# EAGLE design parallella_io (EAGLE 7.2.0)
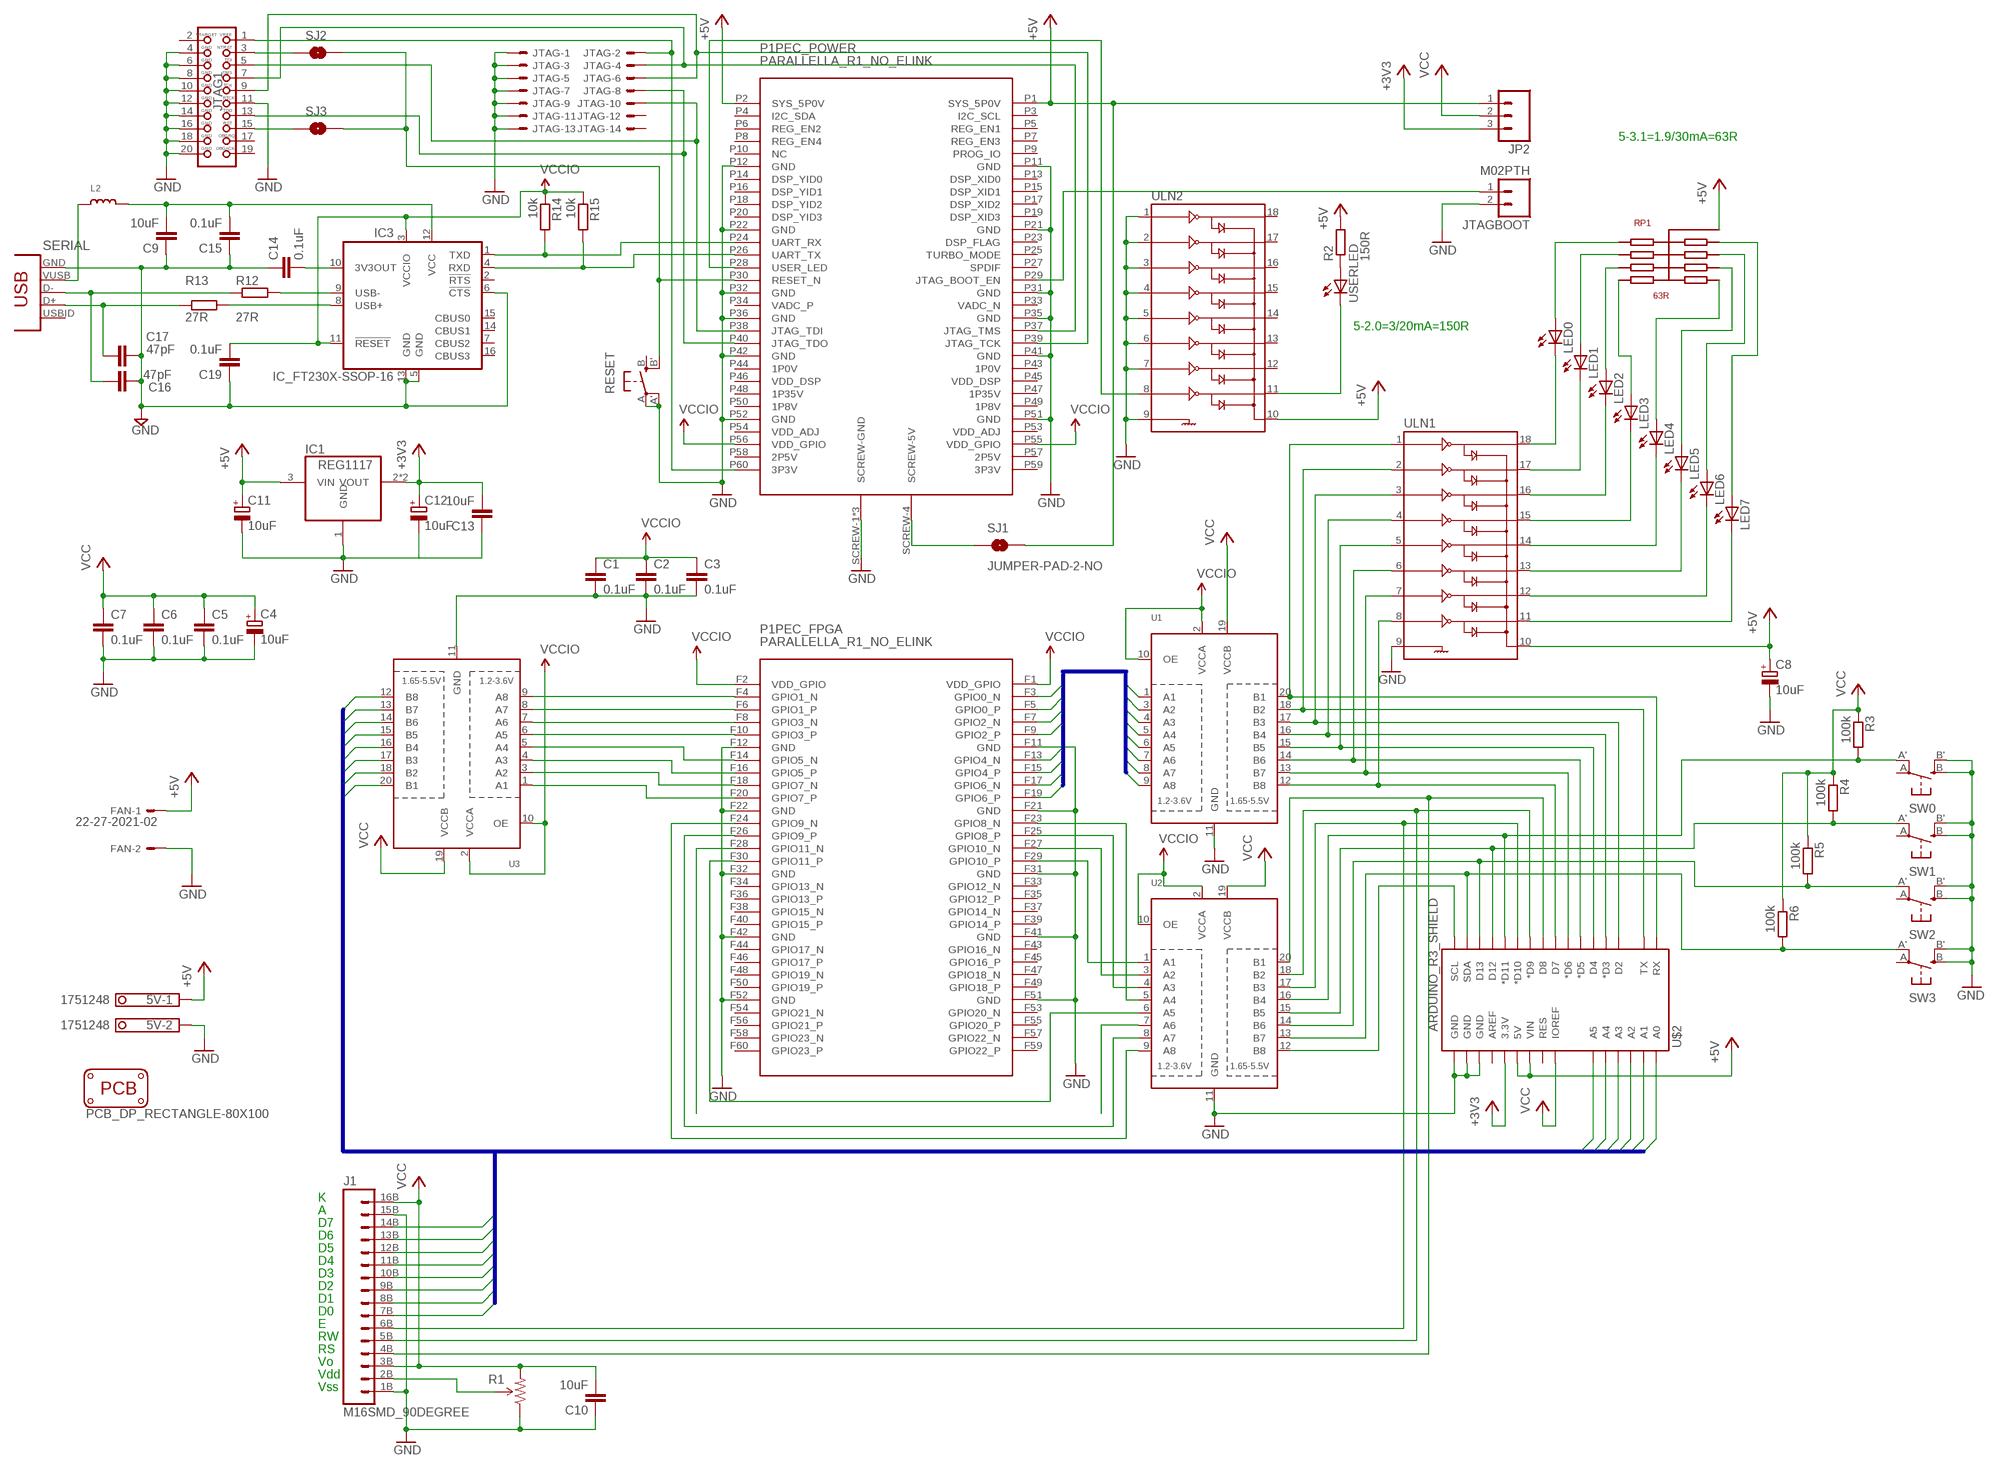
[diagram p0: schematic, sheet 1]

## Parts
5V  1751248  [1751248]
C1  0.1uF  C-EUC0603-N  [C0603-N]
C2  0.1uF  C-EUC0603-N  [C0603-N]
C3  0.1uF  C-EUC0603-N  [C0603-N]
C4  10uF  CPOL-EUD/7343-31W  [D/7343-31W]
C5  0.1uF  C-EUC0603-N  [C0603-N]
C6  0.1uF  C-EUC0603-N  [C0603-N]
C7  0.1uF  C-EUC0603-N  [C0603-N]
C8  10uF  CPOL-EUD/7343-31W  [D/7343-31W]
C9  10uF  C-EUC0603-N  [C0603-N]
C10  10uF  C-EUC0603-N  [C0603-N]
C11  10uF  CPOL-EUD/7343-31W  [D/7343-31W]
C12  10uF  CPOL-EUD/7343-31W  [D/7343-31W]
C13  10uF  C-EUC0603-N  [C0603-N]
C14  0.1uF  C-EUC0603-N  [C0603-N]
C15  0.1uF  C-EUC0603-N  [C0603-N]
C16  47pF  C-EUC0603-N  [C0603-N]
C17  47pF  C-EUC0603-N  [C0603-N]
C19  0.1uF  C-EUC0603-N  [C0603-N]
FAN  22-27-2021-02  [6410-02]
IC1  REG1117  [SOT223]
IC3  IC_FT230X-SSOP-16  [SSOP-16-FTDI]
J1  M16SMD_90DEGREE  [1X16_SMD_90DEGREE]
JP2  M03LONGPADS  [1X03_LONGPADS]
JTAG  87758-1416  [87758-1416]
JTAG1  JTAG-ARM  [JTAG-ARM]
JTAGBOOT  M02PTH  [1X02]
L2  INDUCTOR0805  [0805]
LED0  LED1206  [LED-1206]
LED1  LED1206  [LED-1206]
LED2  LED1206  [LED-1206]
LED3  LED1206  [LED-1206]
LED4  LED1206  [LED-1206]
LED5  LED1206  [LED-1206]
LED6  LED1206  [LED-1206]
LED7  LED1206  [LED-1206]
P1  PARALLELLA_R1_NO_ELINK  [PARALLELLA_R1_NO_ELINK]
PCB1  PCB_DP_RECTANGLE-80X100  [DP10080_V1]
R1  TRIMPOT  [TRIMPOT-5MM-V2]
R2  150R  R-EU_R0603-N  [R0603-N]
R3  100k  R-EU_R0603-N  [R0603-N]
R4  100k  R-EU_R0603-N  [R0603-N]
R5  100k  R-EU_R0603-N  [R0603-N]
R6  100k  R-EU_R0603-N  [R0603-N]
R12  27R  R-EU_R0603-N  [R0603-N]
R13  27R  R-EU_R0603-N  [R0603-N]
R14  10k  R-EU_R0603-S  [R0603-S]
R15  10k  R-EU_R0603-N  [R0603-N]
RESET  SPST_TACT-EVQQ2  [EVQ-Q2]
RP1  63R  745C101745C101  [745C10]
SERIAL  CON-USB-F-MINI-B  [CONN_USB_MINI-B]
SJ1  JUMPER-PAD-2-NO  [PAD-JUMPER-2-NO_NO_SILK]
SJ2  JUMPER-PAD-2-NO  [PAD-JUMPER-2-NO_NO_SILK]
SJ3  JUMPER-PAD-2-NO  [PAD-JUMPER-2-NO_NO_SILK]
SW0  SPST_TACT-EVQQ2  [EVQ-Q2]
SW1  SPST_TACT-EVQQ2  [EVQ-Q2]
SW2  SPST_TACT-EVQQ2  [EVQ-Q2]
SW3  SPST_TACT-EVQQ2  [EVQ-Q2]
U1  TXB0108PWR  [TSSOP20]
U2  TXB0108PWR  [TSSOP20]
U3  TXB0108PWR  [TSSOP20]
U$2  ARDUINO_R3_SHIELD  [UNO_R3_SHIELD]
ULN1  ULN2803SOICW  [SO18L]
ULN2  ULN2803SOICW  [SO18L]
USERLED  LED1206  [LED-1206]

## Nets
3V3OUT: C14.2 IC3.10(3V3OUT)
+3V3: C12.+ C13.2 IC1.2(VOUT) IC1.4(VOUT) JP2.3 U$2.3.3V
+5V: 5V.1 C8.+ C11.+ FAN.1 IC1.3(VIN) JP2.1 P1.P1(PEC_POWER:SYS_5P0V) P1.P2(PEC_POWER:SYS_5P0V) R2.2 RP1.1(COMMON) RP1.6(COMMON) SJ1.2 U$2.5V U$2.VIN ULN1.10 ULN2.10
A0: J1.7B U3.20(B1) U$2.A0
A1: J1.8B U3.18(B2) U$2.A1
A2: J1.9B U3.17(B3) U$2.A2
A3: J1.10B U3.16(B4) U$2.A3
A4: J1.11B U3.15(B5) U$2.A4
A5: J1.12B U3.14(B6) U$2.A5
A6: J1.13B U3.13(B7)
A7: J1.14B U3.12(B8)
B0: P1.F19(PEC_FPGA:GPIO6_P) U1.1(A1)
B1: P1.F17(PEC_FPGA:GPIO6_N) U1.3(A2)
B2: P1.F15(PEC_FPGA:GPIO4_P) U1.4(A3)
B3: P1.F13(PEC_FPGA:GPIO4_N) U1.5(A4)
B4: P1.F9(PEC_FPGA:GPIO2_P) U1.6(A5)
B5: P1.F7(PEC_FPGA:GPIO2_N) U1.7(A6)
B6: P1.F5(PEC_FPGA:GPIO0_P) U1.8(A7)
B7: P1.F3(PEC_FPGA:GPIO0_N) U1.9(A8)
GND: 5V.2 C1.2 C2.2 C3.2 C4.- C5.2 C6.2 C7.2 C8.- C9.1 C10.1 C11.- C12.- C13.1 C14.1 C15.1 C16.2 C17.2 C19.1 FAN.2 IC1.1(GND) IC3.5(GND) IC3.6(!CTS) IC3.13(GND) J1.1B J1.15B JTAG1.4 JTAG1.6 JTAG1.8 JTAG1.10 JTAG1.11 JTAG1.12 JTAG1.14 JTAG1.16 JTAG1.18 JTAG1.20 JTAG.1 JTAG.3 JTAG.5 JTAG.7 JTAG.9 JTAG.11 JTAG.13 JTAGBOOT.2 P1.F11(PEC_FPGA:GND) P1.F12(PEC_FPGA:GND) P1.F21(PEC_FPGA:GND) P1.F22(PEC_FPGA:GND) P1.F31(PEC_FPGA:GND) P1.F32(PEC_FPGA:GND) P1.F41(PEC_FPGA:GND) P1.F42(PEC_FPGA:GND) P1.F51(PEC_FPGA:GND) P1.F52(PEC_FPGA:GND) P1.P11(PEC_POWER:GND) P1.P12(PEC_POWER:GND) P1.P21(PEC_POWER:GND) P1.P22(PEC_POWER:GND) P1.P31(PEC_POWER:GND) P1.P32(PEC_POWER:GND) P1.P35(PEC_POWER:GND) P1.P36(PEC_POWER:GND) P1.P41(PEC_POWER:GND) P1.P42(PEC_POWER:GND) P1.P51(PEC_POWER:GND) P1.P52(PEC_POWER:GND) P1.SCREW-1(PEC_POWER:SCREW-GND) P1.SCREW-2(PEC_POWER:SCREW-GND) P1.SCREW-3(PEC_POWER:SCREW-GND) R1.A(CCW) RESET.A'(P1) RESET.A(P) SERIAL.GND SW0.B'(S1) SW0.B(S) SW1.B'(S1) SW1.B(S) SW2.B'(S1) SW2.B(S) SW3.B'(S1) SW3.B(S) U1.11(GND) U2.11(GND) U3.11(GND) U$2.GND@0(GND) U$2.GND@1(GND) U$2.GND@2(GND) ULN1.9 ULN2.1 ULN2.2 ULN2.3 ULN2.4 ULN2.5 ULN2.6 ULN2.7 ULN2.9
N$1: JTAGBOOT.1 P1.P29(PEC_POWER:JTAG_BOOT_EN)
N$2: P1.F10(PEC_FPGA:GPIO3_P) U3.6(A5)
N$3: P1.F8(PEC_FPGA:GPIO3_N) U3.7(A6)
N$4: P1.F6(PEC_FPGA:GPIO1_P) U3.8(A7)
N$5: P1.F4(PEC_FPGA:GPIO1_N) U3.9(A8)
N$6: JTAG1.1 JTAG.2 P1.P60(PEC_POWER:3P3V)
N$7: JTAG1.3 SJ2.1
N$8: P1.SCREW-4(PEC_POWER:SCREW-5V) SJ1.1
N$9: P1.F23(PEC_FPGA:GPIO8_N) U2.5(A4)
N$10: P1.F25(PEC_FPGA:GPIO8_P) U2.4(A3)
N$11: P1.F27(PEC_FPGA:GPIO10_N) U2.3(A2)
N$12: P1.F29(PEC_FPGA:GPIO10_P) U2.1(A1)
N$13: P1.F30(PEC_FPGA:GPIO11_P) U2.6(A5)
N$14: P1.F28(PEC_FPGA:GPIO11_N)
N$15: P1.F26(PEC_FPGA:GPIO9_P) U2.8(A7)
N$16: P1.F24(PEC_FPGA:GPIO9_N) U2.9(A8)
N$17: R2.1 USERLED.A
N$18: ULN2.11 USERLED.C
N$19: P1.P28(PEC_POWER:USER_LED) ULN2.8
N$20: JTAG1.15 SJ3.1
N$21: P1.F14(PEC_FPGA:GPIO5_N) U3.5(A4)
N$22: P1.F16(PEC_FPGA:GPIO5_P) U3.4(A3)
N$23: P1.F18(PEC_FPGA:GPIO7_N) U3.3(A2)
N$24: P1.F20(PEC_FPGA:GPIO7_P) U3.1(A1)
N$25: U1.16(B4) U$2.D3(*D3) ULN1.4
N$26: U1.15(B5) U$2.D4 ULN1.5
N$27: U1.14(B6) U$2.D5(*D5) ULN1.6
N$28: U1.20(B1) U$2.RX ULN1.1
N$29: U1.18(B2) U$2.TX ULN1.2
N$30: U1.17(B3) U$2.D2 ULN1.3
N$31: U1.13(B7) U$2.D6(*D6) ULN1.7
N$32: U1.12(B8) U$2.D7 ULN1.8
N$33: J1.4B U2.20(B1) U$2.D8
N$34: J1.5B U2.18(B2) U$2.D9(*D9)
N$35: J1.6B U2.17(B3) U$2.D10(*D10)
N$36: R3.2 SW0.A'(P1) U2.16(B4) U$2.D11(*D11)
N$37: JTAG1.13 JTAG.8 P1.P40(PEC_POWER:JTAG_TDO)
N$38: R6.2 SW3.A'(P1) U2.13(B7) U$2.SDA
N$39: R5.2 SW2.A'(P1) U2.14(B6) U$2.D13
N$40: R4.2 SW1.A'(P1) U2.15(B5) U$2.D12
N$41: U2.12(B8) U$2.SCL
N$43: JTAG1.5 JTAG.10 P1.P38(PEC_POWER:JTAG_TDI)
N$45: JTAG1.7 JTAG.4 P1.P37(PEC_POWER:JTAG_TMS)
N$46: JTAG1.9 JTAG.6 P1.P39(PEC_POWER:JTAG_TCK)
N$47: LED0.A RP1.10(R8)
N$48: LED1.A RP1.9(R7)
N$49: LED2.A RP1.8(R6)
N$50: LED3.A RP1.7(R5)
N$51: LED4.A RP1.5(R4)
N$52: LED0.C ULN1.18
N$53: LED1.C ULN1.17
N$54: LED2.C ULN1.16
N$55: LED3.C ULN1.15
N$56: LED4.C ULN1.14
N$57: LED5.C ULN1.13
N$58: LED6.C ULN1.12
N$59: LED7.C ULN1.11
N$60: LED5.A RP1.4(R3)
N$61: LED6.A RP1.3(R2)
N$62: LED7.A RP1.2(R1)
N$63: C16.1 R12.1 SERIAL.D-
N$64: P1.P30(PEC_POWER:RESET_N) RESET.B'(S1) SJ2.2 SJ3.2
N$65: C17.1 R13.1 SERIAL.D+
N$66: J1.2B R1.B(WIPER)
N$67: IC3.9(USB-) R12.2
N$68: IC3.8(USB+) R13.2
N$69: U2.7(A6)
N$70: L2.1 SERIAL.VUSB
RXD: IC3.1(TXD) P1.P24(PEC_POWER:UART_RX) R14.2
TXD: IC3.4(RXD) P1.P26(PEC_POWER:UART_TX) R15.2
VCC: C4.+ C5.1 C6.1 C7.1 C10.2 J1.3B J1.16B JP2.2 R1.C(CW) R3.1 R4.1 R5.1 R6.1 U1.19(VCCB) U2.19(VCCB) U3.19(VCCB) U$2.IOREF
VCCIO: C1.1 C2.1 C3.1 C19.2 IC3.3(VCCIO) IC3.11(!RESET) P1.F1(PEC_FPGA:VDD_GPIO) P1.F2(PEC_FPGA:VDD_GPIO) P1.P55(PEC_POWER:VDD_GPIO) P1.P56(PEC_POWER:VDD_GPIO) R14.1 R15.1 U1.2(VCCA) U1.10(OE) U2.2(VCCA) U2.10(OE) U3.2(VCCA) U3.10(OE)
VUSB: C9.2 C15.2 IC3.12(VCC) L2.2
Unconnected: IC3.2(!RTS) IC3.7(CBUS2) IC3.14(CBUS1) IC3.15(CBUS0) IC3.16(CBUS3) JTAG1.2 JTAG1.17 JTAG1.19 JTAG.12 JTAG.14 P1.F33(PEC_FPGA:GPIO12_N) P1.F34(PEC_FPGA:GPIO13_N) P1.F35(PEC_FPGA:GPIO12_P) P1.F36(PEC_FPGA:GPIO13_P) P1.F37(PEC_FPGA:GPIO14_N) P1.F38(PEC_FPGA:GPIO15_N) P1.F39(PEC_FPGA:GPIO14_P) P1.F40(PEC_FPGA:GPIO15_P) P1.F43(PEC_FPGA:GPIO16_N) P1.F44(PEC_FPGA:GPIO17_N) P1.F45(PEC_FPGA:GPIO16_P) P1.F46(PEC_FPGA:GPIO17_P) P1.F47(PEC_FPGA:GPIO18_N) P1.F48(PEC_FPGA:GPIO19_N) P1.F49(PEC_FPGA:GPIO18_P) P1.F50(PEC_FPGA:GPIO19_P) P1.F53(PEC_FPGA:GPIO20_N) P1.F54(PEC_FPGA:GPIO21_N) P1.F55(PEC_FPGA:GPIO20_P) P1.F56(PEC_FPGA:GPIO21_P) P1.F57(PEC_FPGA:GPIO22_N) P1.F58(PEC_FPGA:GPIO23_N) P1.F59(PEC_FPGA:GPIO22_P) P1.F60(PEC_FPGA:GPIO23_P) P1.P3(PEC_POWER:I2C_SCL) P1.P4(PEC_POWER:I2C_SDA) P1.P5(PEC_POWER:REG_EN1) P1.P6(PEC_POWER:REG_EN2) P1.P7(PEC_POWER:REG_EN3) P1.P8(PEC_POWER:REG_EN4) P1.P9(PEC_POWER:PROG_IO) P1.P10(PEC_POWER:NC) P1.P13(PEC_POWER:DSP_XID0) P1.P14(PEC_POWER:DSP_YID0) P1.P15(PEC_POWER:DSP_XID1) P1.P16(PEC_POWER:DSP_YID1) P1.P17(PEC_POWER:DSP_XID2) P1.P18(PEC_POWER:DSP_YID2) P1.P19(PEC_POWER:DSP_XID3) P1.P20(PEC_POWER:DSP_YID3) P1.P23(PEC_POWER:DSP_FLAG) P1.P25(PEC_POWER:TURBO_MODE) P1.P27(PEC_POWER:SPDIF) P1.P33(PEC_POWER:VADC_N) P1.P34(PEC_POWER:VADC_P) P1.P43(PEC_POWER:1P0V) P1.P44(PEC_POWER:1P0V) P1.P45(PEC_POWER:VDD_DSP) P1.P46(PEC_POWER:VDD_DSP) P1.P47(PEC_POWER:1P35V) P1.P48(PEC_POWER:1P35V) P1.P49(PEC_POWER:1P8V) P1.P50(PEC_POWER:1P8V) P1.P53(PEC_POWER:VDD_ADJ) P1.P54(PEC_POWER:VDD_ADJ) P1.P57(PEC_POWER:2P5V) P1.P58(PEC_POWER:2P5V) P1.P59(PEC_POWER:3P3V) RESET.B(S) SERIAL.BODY@1(BODY) SERIAL.BODY@2(BODY) SERIAL.BODY@3(BODY) SERIAL.BODY@4(BODY) SERIAL.ID(USBID) SW0.A(P) SW1.A(P) SW2.A(P) SW3.A(P) U$2.AREF U$2.RES ULN2.12 ULN2.13 ULN2.14 ULN2.15 ULN2.16 ULN2.17 ULN2.18

## Buses
A[0..7]
B[0..7]

## Notes on the sheet
- 5-3.1=1.9/30mA=63R
- 5-2.0=3/20mA=150R
- K
- A
- D7
- D6
- D5
- D4
- D3
- D2
- D1
- D0
- E
- RW
- RS
- Vo
- Vdd
- Vss

## Library data of the parts
5V = con-phoenix-350:1751248: MKDS 1/ 2-3,5 Printklemme Nennstrom: 10 A Bemessungsspannung: 160 V Raster: 3,5 mm Polzahl: 2 Montageart: Löten Anschlussart: Schraubanschluss Anschlussrichtung vom Leiter zur Platine: 0° Source: http://eshop.phoenixcontact.com .. 1751248.pdf; OC_FARNELL: unknown; OC_NEWARK: unknown
C1-C3 C5-C7 C9 C10 C13-C15 C19 = passives:C-EU: CAPACITOR, European symbol
C4 C8 C11 C12 = rcl:CPOL-EU: POLARIZED CAPACITOR, European symbol
C16 C17 = passives:C-EU: CAPACITOR, European symbol; MOUSER: 77-VJ0603A470KXAAC
FAN = con-molex:22-?-02: CONNECTOR wire to board 2.54 mm (.1 inch) pitch header; OC_FARNELL: unknown; OC_NEWARK: unknown
IC1 = semiconductors:REG1117: 800mA and 1A Low Dropout (LDO) Positive Regulator 1.8V, 2.5V, 2.85V, 3.3V, 5V, and Adj; MOUSER: 701-SPX1117M3-L-33TR; MPN: REG1117; OC_FARNELL: 1097566; OC_NEWARK: 14P6981
IC3 = dp_devices:IC_FT230X: BASIC USB to UART IC; MOUSER: 895-FT230XS-R
J1 = mechanical:M16: 1x16 .1" header
JP2 = SparkFun-Connectors:M03: Header 3 Standard 3-pin 0.1" header. Use with straight break away headers (SKU : PRT-00116), right angle break away headers (PRT-00553), swiss pins (PRT-00743), machine pins (PRT-00117), and female headers (PRT-00115). Molex polarized connector foot print use with SKU : PRT-08232 with associated crimp pins and housings.
JTAG = con-molex:87758-1416: 14 Pin - 2mm Dual Row Single Wafer, Vertical T/H HDR Source: http://www.molex.com/pdm_docs/sd/877580616_sd.pdf; MF: MOLEX; MOUSER: 538-87833-5320; MPN: 87758-1416; OC_FARNELL: 7472358; OC_NEWARK: 59J1562
JTAG1 = philips-6:JTAG-ARM
JTAGBOOT = SparkFun-Connectors:M02: Standard 2-pin 0.1" header. Use with - straight break away headers ( PRT-00116) - right angle break away headers (PRT-00553) - swiss pins (PRT-00743) - machine pins (PRT-00117) - female headers (PRT-00115) Molex polarized connector foot print use with: PRT-08233 with associated crimp pins and housings. 2.54_SCREWTERM for use with PRT-10571. 3.5mm Screw Terminal footprints for PRT-08084 5mm Screw Terminal footprints for use with PRT-08432
L2 = microbuilder:INDUCTOR: Inductors 0603: 10nH Ceramic Inductor - microwire antenna/RF (Digikey: 712-1434-2-ND) 0805: 560nH Ceramic Inductor - RF (Digikey: 553-1047-1-ND) 270nH Ceramic Inductor - Q = 40@250MHz, +-5%, 1 Ohm DC Resistance (Digikey: 535-10506-2-ND) 1007 (2518 Metric) SMT: 10µH 10% 250mOhm 820mA 1007 Inductor (Digikey: 587-2189-1-ND) 22µH 10% 500mOhm 580mA 1007 Inductor (Digikey: 587-2190-1-ND) 47µH 10% 950mOhm 420mA 1007 Inductor (Digikey: 587-2191-1-ND) 47µH 5% 100mOhm 1A 1008 Inductor (Digikey: 732-1816-1-ND) 5.0x5.0mm (Taiyo Yuden NR5040 Series) 6.8µH 20% 2.3A 64mOhm Inductor (Digikey: 587-2374-2-ND) 5.0x5.0mm (TDK VLC5045 Series) 4.7µH 20% 3.3A 34mOhm Inductor (Digikey: 445-6526-1-ND) 6.8µH 20% 2.7A 46mOhm Inductor (Digikey: 445-6527-1-ND) 6.0x6.0mm (TDK VLC6045 Series) 4.7µH 20% 3.8A 27mOhm Inductor (Digikey: 445-6538-2-ND) 6.8µH 20% 3A 41mOhm Inductor (Digikey: 445-6540-1-ND) 6.2µH 30% 2.2A 45mOhm Inductor (Digikey: SRR5028-6R2YCT-ND) - Not TDK VLC6045 but footprint should match 6.0x6.0mm (TDK SLF6045 Series) 6.8uH 30% 2A 33mOhm Inductor (Digikey: 445-4572-1-ND, Mouser: 810-SLF645T6R8N2R0PF)
LED0 LED1-LED7 USERLED = semiconductors:LED: Light Emitting Diode
P1 = mechanical:PARALLELLA_R1_NO_ELINK: Parallella full device [rev 1]
PCB1 = dp_pcb:PCB_DP_RECTANGLE: Dangerous Prototypes Standard Rectangular PCB sizes
R1 = SparkFun-Electromechanical:TRIMPOT: Various small potentiometers for "set-and-forget" applications; MOUSER: 72-TS53YL-10K
R2-R6 R14 R15 = passives:R-EU_: RESISTOR, European symbol
R12 R13 = passives:R-EU_: RESISTOR, European symbol; MOUSER: 71-CRCW060327R0JNEB
RESET SW0 SW1-SW3 = adafruit:SPST_TACT: SMT 6mm switch, EVQQ2 series http://www.ladyada.net/library/eagle
RP1 = passives:745C101; MOUSER: 774-745C101680JP
SERIAL = dp_devices:CON-USB-F: USB Female connector
SJ1-SJ3 = SparkFun-Passives:JUMPER-PAD-2-NO
U1-U3 = adafruit:TXB0108PWR: 8-Bit Bi-Directional Level Shifter 1.2V-3.6V (VCCA) to 1.65V-5.5V (VCCB) bi-directional level shifter with auto direction sensing. Max data rate - VCCA 1.8V: 20Mbps (50ns), VCCA 3.3V: 100Mbps (10ns) Digikey: 296-21527-1-ND; MOUSER: 595-TXB0108PWR
U$2 = SparkFun-Boards:ARDUINO_R3_SHIELD: Shield form compatible with the Arduino Uno R3.
ULN1 ULN2 = SparkFun-PowerIC:ULN2803: Darlington Driver ULN2803 Darlington array. 500mA max per channel, 8-channel package. Spark Fun Electronics SKU : COM-00312; MOUSER: 595-ULN2803ADWR

## Board
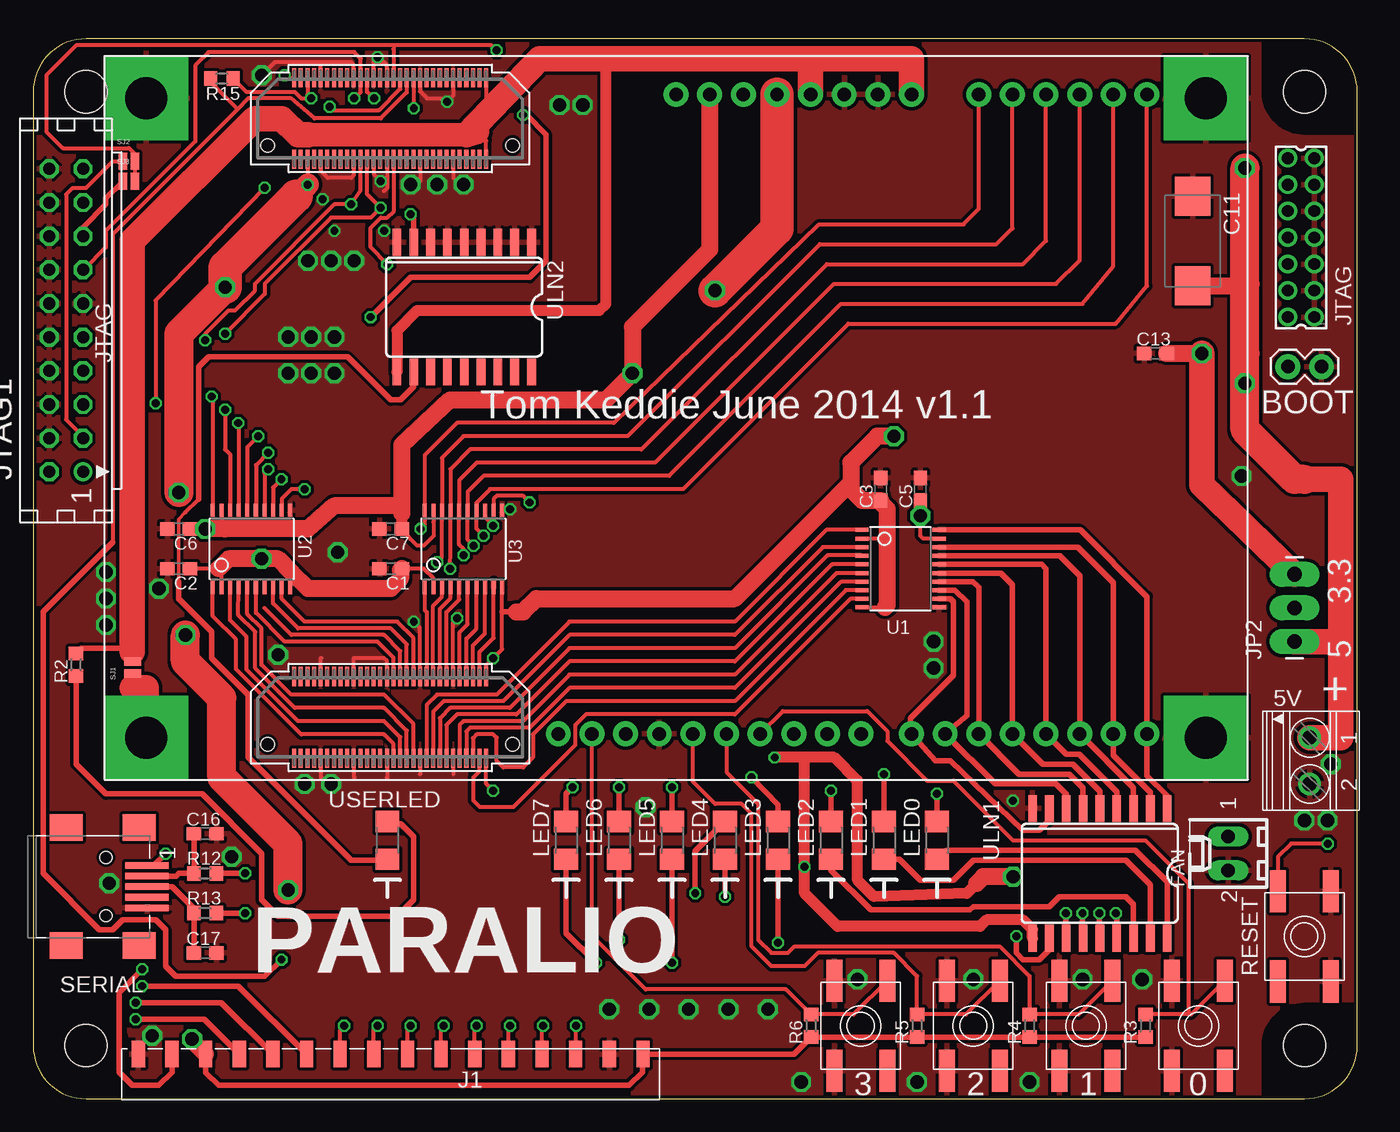
[diagram p1: board, top side]
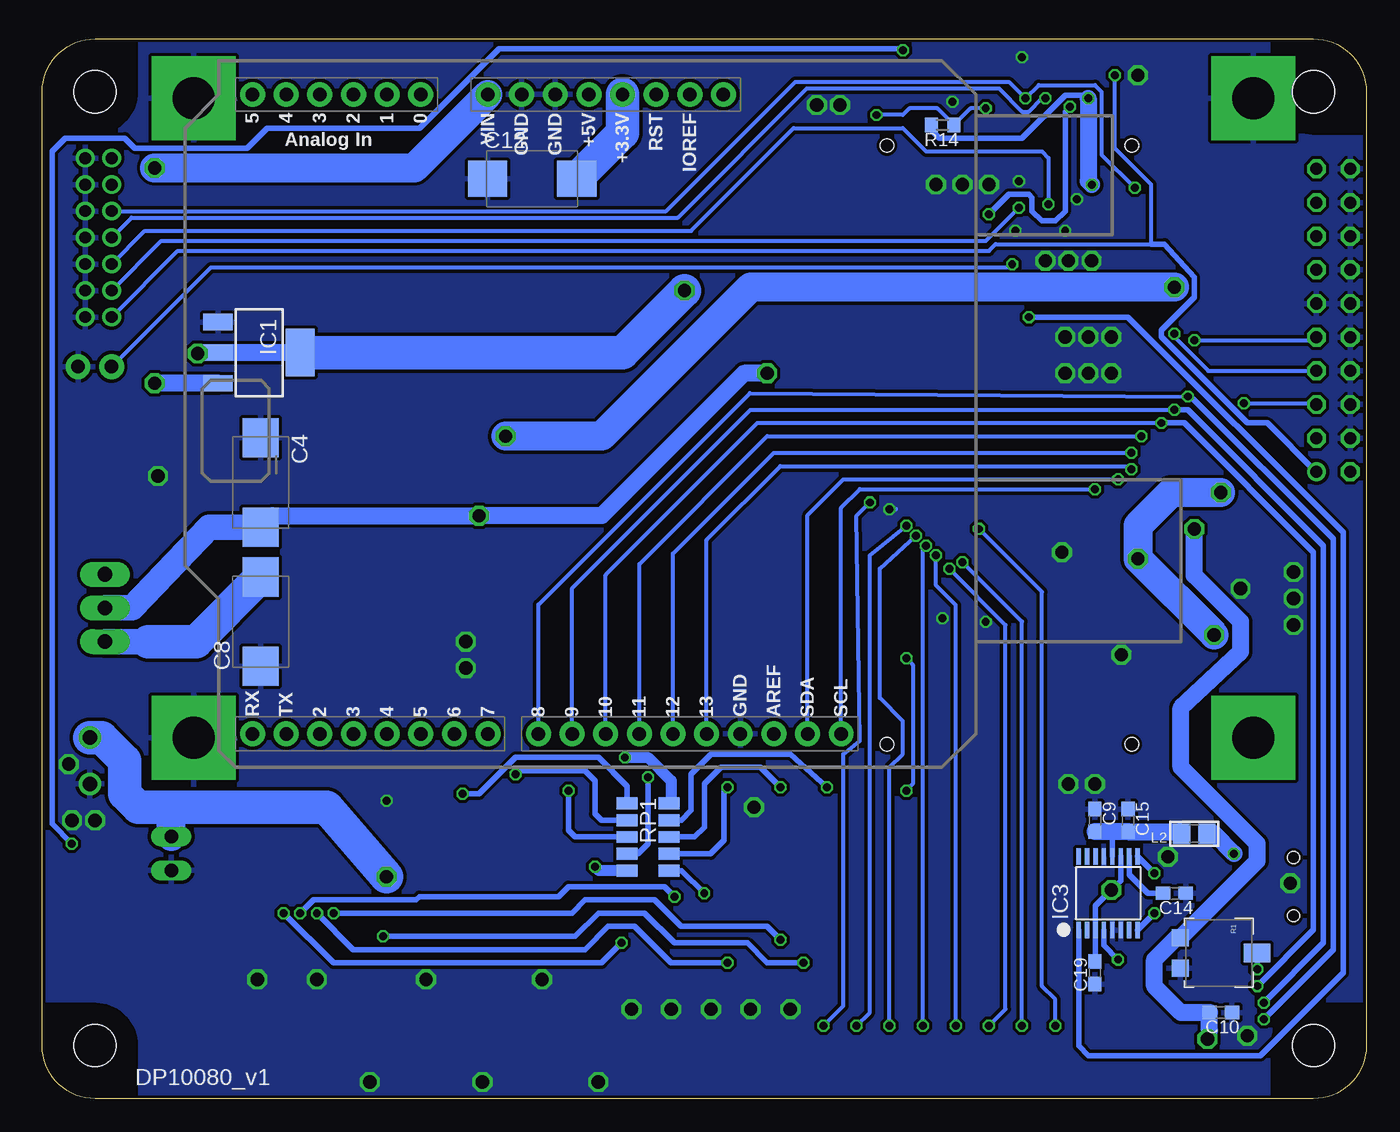
[diagram p2: board, bottom side, seen from below]

Size 100 x 80 mm. Coordinates in mm from the lower left corner, seen from the top.
Copper layers (1*16): Top 0.035mm / dielectric 1.5mm / Bottom 0.035mm
Design rules "dirt_cheap_dirty_boards.v1": minimum track width 5mil, minimum drill 12mil, track to track 5mil, track to pad 5mil, pad to pad 5mil, via to via 5mil, smd to smd 0mil, copper to edge 10mil, drill to drill 10mil, minimum pad ring 10mil, minimum via ring 6mil, stop-mask expansion 2mil, vias tented up to drill 25mil, thermal gap 10mil

### Footprints (pad centres in the part's own frame; a part is rotated, then mirrored left to right if it is on the bottom)
1751248 = drill 1.1 pad 1.7: 1 -1.75,-0.1; 2 1.75,-0.1
C0603-N = smd 1.1 x 1: 1 -0.85,0; 2 0.85,0
D/7343-31W = smd 2.95 x 2.7: + 3.375,0; - -3.375,0
6410-02 = drill 1.016 long: 1 1.27,0; 2 -1.27,0
SOT223 = smd 1.219 x 2.235: 1 -2.311,-3.099; 2 0,-3.099; 3 2.311,-3.099 | smd 3.6 x 2.2: 4 0,3.099
SSOP-16-FTDI = smd 0.32 x 1.26: 1 -2.223,-2.779; 2 -1.588,-2.779; 3 -0.953,-2.779; 4 -0.318,-2.779; 5 0.317,-2.779; 6 0.952,-2.779; 7 1.587,-2.779; 8 2.222,-2.779; 9 2.222,2.779; 10 1.587,2.779; 11 0.952,2.779; 12 0.317,2.779; 13 -0.318,2.779; 14 -0.953,2.779; 15 -1.588,2.779; 16 -2.223,2.779
1X16_SMD_90DEGREE = smd 1 x 2: 1B -19.05,-1.65; 2B -16.51,-1.65; 3B -13.97,-1.65; 4B -11.43,-1.65; 5B -8.89,-1.65; 6B -6.35,-1.65; 7B -3.81,-1.65; 8B -1.27,-1.65; 9B 1.27,-1.65; 10B 3.81,-1.65; 11B 6.35,-1.65; 12B 8.89,-1.65; 13B 11.43,-1.65; 14B 13.97,-1.65; 15B 16.51,-1.65; 16B 19.05,-1.65
1X03_LONGPADS = drill 1.118 pad 1.88 long: 1 0,0; 2 2.54,0; 3 5.08,0
87758-1416 = drill 0.9 pad 1.27: 1 -6,-1; 2 -6,1; 3 -4,-1; 4 -4,1; 5 -2,-1; 6 -2,1; 7 0,-1; 8 0,1; 9 2,-1; 10 2,1; 11 4,-1; 12 4,1; 13 6,-1; 14 6,1
JTAG-ARM = drill 0.914: 1 -11.43,-1.27 | drill 0.914 octagon: 2 -11.43,1.27; 3 -8.89,-1.27; 4 -8.89,1.27; 5 -6.35,-1.27; 6 -6.35,1.27; 7 -3.81,-1.27; 8 -3.81,1.27; 9 -1.27,-1.27; 10 -1.27,1.27; 11 1.27,-1.27; 12 1.27,1.27; 13 3.81,-1.27; 14 3.81,1.27; 15 6.35,-1.27; 16 6.35,1.27; 17 8.89,-1.27; 18 8.89,1.27; 19 11.43,-1.27; 20 11.43,1.27
1X02 = drill 1.016 pad 1.88: 1 0,0; 2 2.54,0
0805 = smd 1.3 x 1.5: 1 -0.95,0; 2 0.95,0
LED-1206 = smd 1.6 x 1.803: A 1.422,0; C -1.422,0
PARALLELLA_R1_NO_ELINK = smd 0.305 x 1.448: F1 25.665,-1.562; F2 25.665,4.61; F3 25.165,-1.562; F4 25.165,4.61; F5 24.665,-1.562; F6 24.665,4.61; F7 24.165,-1.562; F8 24.165,4.61; F9 23.665,-1.562; F10 23.665,4.61; F11 23.165,-1.562; F12 23.165,4.61; F13 22.665,-1.562; F14 22.665,4.61; F15 22.165,-1.562; F16 22.165,4.61; F17 21.665,-1.562; F18 21.665,4.61; F19 21.165,-1.562; F20 21.165,4.61; F21 20.665,-1.562; F22 20.665,4.61; F23 20.165,-1.562; F24 20.165,4.61; F25 19.665,-1.562; F26 19.665,4.61; F27 19.165,-1.562; F28 19.165,4.61; F29 18.665,-1.562; F30 18.665,4.61; F31 18.165,-1.562; F32 18.165,4.61; F33 17.665,-1.562; F34 17.665,4.61; F35 17.165,-1.562; F36 17.165,4.61; F37 16.665,-1.562; F38 16.665,4.61; F39 16.165,-1.562; F40 16.165,4.61; F41 15.665,-1.562; F42 15.665,4.61; F43 15.165,-1.562; F44 15.165,4.61; F45 14.665,-1.562; F46 14.665,4.61; F47 14.165,-1.562; F48 14.165,4.61; F49 13.665,-1.562; F50 13.665,4.61; F51 13.165,-1.562; F52 13.165,4.61; F53 12.665,-1.562; F54 12.665,4.61; F55 12.165,-1.562; F56 12.165,4.61; F57 11.665,-1.562; F58 11.665,4.61; F59 11.165,-1.562; F60 11.165,4.61; P1 25.665,43.65; P2 25.665,49.822; P3 25.165,43.65; P4 25.165,49.822; P5 24.665,43.65; P6 24.665,49.822; P7 24.165,43.65; P8 24.165,49.822; P9 23.665,43.65; P10 23.665,49.822; P11 23.165,43.65; P12 23.165,49.822; P13 22.665,43.65; P14 22.665,49.822; P15 22.165,43.65; P16 22.165,49.822; P17 21.665,43.65; P18 21.665,49.822; P19 21.165,43.65; P20 21.165,49.822; P21 20.665,43.65; P22 20.665,49.822; P23 20.165,43.65; P24 20.165,49.822; P25 19.665,43.65; P26 19.665,49.822; P27 19.165,43.65; P28 19.165,49.822; P29 18.665,43.65; P30 18.665,49.822; P31 18.165,43.65; P32 18.165,49.822; P33 17.665,43.65; P34 17.665,49.822; P35 17.165,43.65; P36 17.165,49.822; P37 16.665,43.65; P38 16.665,49.822; P39 16.165,43.65; P40 16.165,49.822; P41 15.665,43.65; P42 15.665,49.822; P43 15.165,43.65; P44 15.165,49.822; P45 14.665,43.65; P46 14.665,49.822; P47 14.165,43.65; P48 14.165,49.822; P49 13.665,43.65; P50 13.665,49.822; P51 13.165,43.65; P52 13.165,49.822; P53 12.665,43.65; P54 12.665,49.822; P55 12.165,43.65; P56 12.165,49.822; P57 11.665,43.65; P58 11.665,49.822; P59 11.165,43.65; P60 11.165,49.822 | drill 3.175 pad 6.35 square: SCREW-1 0,48.26; SCREW-2 80.01,48.26; SCREW-3 80.01,0; SCREW-4 0,0 | hole 1.016: 27.661,-0.508; 9.169,-0.508; 27.661,44.704; 9.169,44.704
DP10080_V1 = hole 3.2: 4,4; 96,4; 96,76; 4,76
TRIMPOT-5MM-V2 = smd 1.3 x 1.3: A 1.15,-2.54; C -1.15,-2.54 | smd 1.402 x 2: B 0,3.239
R0603-N = smd 1 x 1.1: 1 -0.85,0; 2 0.85,0
R0603-S = smd 1 x 1.1: 1 -0.85,0; 2 0.85,0
EVQ-Q2 = smd 3.2 x 1.2: A -3.4,-2; A' 3.4,-2; B -3.4,2; B' 3.4,2
745C10 = smd 0.9 x 1.6: 1 -2.54,1.587; 2 -1.27,1.587; 3 0,1.587; 4 1.27,1.587; 5 2.54,1.587; 6 2.54,-1.587; 7 1.27,-1.587; 8 0,-1.587; 9 -1.27,-1.587; 10 -2.54,-1.587
CONN_USB_MINI-B = smd 2 x 2.5: BODY@1 -4.45,2.5; BODY@2 4.45,2.5; BODY@3 4.45,-3; BODY@4 -4.45,-3 | smd 0.5 x 3.3: D+ 0,3.1; D- -0.8,3.1; GND 1.6,3.1; ID 0.8,3.1; VUSB -1.6,3.1 | hole 0.9: -2.2,0; 2.2,0
PAD-JUMPER-2-NO_NO_SILK = smd 0.635 x 1.27: 1 -0.45,0; 2 0.45,0
TSSOP20 = smd 0.305 x 0.991: 1 -2.925,-2.918; 2 -2.275,-2.918; 3 -1.625,-2.918; 4 -0.975,-2.918; 5 -0.325,-2.918; 6 0.325,-2.918; 7 0.975,-2.918; 8 1.625,-2.918; 9 2.275,-2.918; 10 2.925,-2.918; 11 2.925,2.918; 12 2.275,2.918; 13 1.625,2.918; 14 0.975,2.918; 15 0.325,2.918; 16 -0.325,2.918; 17 -0.975,2.918; 18 -1.625,2.918; 19 -2.275,2.918; 20 -2.925,2.918
UNO_R3_SHIELD = drill 1.016 pad 1.88: 3.3V 50.8,26.67; 5V 50.8,29.21; A0 50.8,41.91; A1 50.8,44.45; A2 50.8,46.99; A3 50.8,49.53; A4 50.8,52.07; A5 50.8,54.61; AREF 2.54,15.24; D2 2.54,49.53; D3 2.54,46.99; D4 2.54,44.45; D5 2.54,41.91; D6 2.54,39.37; D7 2.54,36.83; D8 2.54,33.02; D9 2.54,30.48; D10 2.54,27.94; D11 2.54,25.4; D12 2.54,22.86; D13 2.54,20.32; GND@0 50.8,31.75; GND@1 50.8,34.29; GND@2 2.54,17.78; IOREF 50.8,21.59; NC 50.8,19.05; RES 50.8,24.13; RX 2.54,54.61; SCL 2.54,10.16; SDA 2.54,12.7; TX 2.54,52.07; VIN 50.8,36.83
SO18L = smd 0.66 x 2.032: 1 -0.635,-4.902; 2 0.635,-4.902; 3 1.905,-4.902; 4 3.175,-4.902; 5 4.445,-4.902; 6 5.715,-4.902; 7 6.985,-4.902; 8 8.255,-4.902; 9 9.525,-4.902; 10 9.525,4.902; 11 8.255,4.902; 12 6.985,4.902; 13 5.715,4.902; 14 4.445,4.902; 15 3.175,4.902; 16 1.905,4.902; 17 0.635,4.902; 18 -0.635,4.902

### Placement (x,y rotation side)
5V  96.5,25.5 270 top
C1  27,40 180 top
C2  11,40 180 top
C3  64,46 90 top
C4  83.5,46.5 270 bottom
C5  67,46 90 top
C6  11,43 180 top
C7  27,43 180 top
C8  83.5,36 90 bottom
C9  20.5,21 270 bottom
C10  11,6.5 180 bottom
C11  87.56,64.75 270 top
C12  63,69.44 0 bottom
C13  84.75,56.25 0 top
C14  14.5,15.5 180 bottom
C15  18,21 270 bottom
C16  13,20 0 top
C17  13,11 0 top
C19  20.5,9.5 90 bottom
FAN  90.25,18.5 90 top
IC1  83.62,56.31 270 bottom
IC3  19.5,15.5 0 bottom
J1  27,5 0 top
JP2  95.25,34.5 90 top
JTAG  95.75,65 90 top
JTAG1  2.5,58.75 90 top
JTAGBOOT  94.75,55.25 0 top
L2  13,20 180 bottom
LED0  68.25,19.5 90 top
LED1  64.25,19.5 90 top
LED2  60.25,19.5 90 top
LED3  56.25,19.5 90 top
LED4  52.25,19.5 90 top
LED5  48.25,19.5 90 top
LED6  44.25,19.5 90 top
LED7  40.25,19.5 90 top
P1  8.55,27.25 0 top
PCB1  0,0 0 top
R1  11.5,11 270 bottom
R2  3.25,32.75 90 top
R3  84,5.5 90 top
R4  75.25,5.5 90 top
R5  66.75,5.5 90 top
R6  58.75,5.5 90 top
R12  13,17 0 top
R13  13,14 0 top
R14  32,73.5 0 bottom
R15  14.25,77 180 top
RESET  96,12.25 90 top
RP1  54.25,19.75 270 bottom
SERIAL  5.5,16 270 top
SJ1  7.51,32.53 90 top
SJ2  7.25,70.75 0 top
SJ3  7.25,69.25 0 top
SW0  88,5.5 90 top
SW1  79.5,5.5 90 top
SW2  71,5.5 90 top
SW3  62.5,5.5 90 top
U1  65.5,40 270 top
U2  16.5,41.5 0 top
U3  32.5,41.5 0 top
U$2  29.5,25 90 bottom
ULN1  85,17 180 top
ULN2  37,59.75 180 top
USERLED  26.75,19.5 90 top

### Tracks (layer width: path | path; a pad name or v marks a point on that pad's centre or on a via)
3V3OUT
  Bottom 0.406: C14.2 16.5,15.5 17.91,16.91 IC3.10
+3V3  (via drill 1)
  Top 1.27: C13.2 87.75,56.25 88.25,55.75
  Top 1.93: v88.25,56.25 88.25,55.75 88.25,46.33 JP2.3
  Top 2.54: v51.5,61 56.17,65.67 U$2.3.3V
  Bottom 1.27: IC1.4 IC1.2 88,56.31 v88.25,56.25
  Bottom 2.54: IC1.4 56.19,56.31 v51.5,61 | C12.+ 56.17,72.89 U$2.3.3V
+5V  (via drill 0.6, 1)
  Top 0.305: P1.P1 34.22,72.28 33.62,72.88 | 33.62,72.88 33.5,73 | P1.P2 34.22,73.47 33.62,72.88
  Top 0.406: 7.5,33.75 7.5,33 SJ1.2 | R2.2 3.65,34 7.5,34
  Top 0.813: 71.25,16.25 70.5,15.5 63.5,15.25 62.25,16.5 62.25,24 60.5,25.75 58.25,25.75 | 58.25,25.75 v58.25,17.5 58.25,15.5 60.75,13 71.5,13 72,13.5 74.75,13.5 75.47,12.78 ULN1.10 | 43.25,78.5 43.25,60 42.75,59.5 29,59.5 27.48,57.98 ULN2.10 | 58.25,25.75 v56,25.75
  Top 1.27: v91.5,54 91.5,56.25 | v74,16.75 71.75,16.75 71.25,16.25 | C11.+ 91.38,61.38 91.5,61.5
  Top 1.778: 32.75,72.75 20.75,72.75
  Top 1.93: 58.71,78.5 43.25,78.5 38.25,78.5 32.75,72.75 33.5,73 | U$2.5V 58.71,78.5 | 58.71,78.5 66.33,78.5 U$2.VIN | 96,46.75 98.75,46.75 98.75,34.5 | JP2.1 98.75,34.5 | 98.75,34.5 98.75,27.25 5V.1 | 20.75,72.75 20,72.75 18.79,73.97 16.71,73.97 7.5,64.75 7.5,34 7.5,33.75
  Top 2.184: 96,46.75 95.25,46.75 91.5,50.5 91.5,56.25 91.5,61.5 v91.5,70.25
  Bottom 0.813: v56,25.75 54.25,25.75 52.5,24 52.5,22.45 RP1.1 | RP1.6 57.96,17.21 v58.25,17.5
  Bottom 1.27: IC1.3 v91.5,54
  Bottom 1.93: JP2.1 92,34.5
  Bottom 2.184: v91.5,70.25 71.88,70.25 U$2.VIN | FAN.1 90.25,22 89.75,22
  Bottom 2.54: 92,34.5 88.38,34.5 C8.+ | v74,16.75 78.5,22 89.75,22 92.75,22 93.75,23 93.75,25.5 95.5,27.25 5V.1
A0  (via drill 0.6)
  Top 0.305: J1.7B 23.19,5.19 v23.5,5.5 | U$2.A0 71.41,67.16 70.25,66 59.36,66 43.86,51 32,51 29.57,48.58 U3.20 29.57,43.33 v29.25,43
  Bottom 0.305: v23.5,5.5 23.5,7.5 24.5,8.5 24.5,38.25 v29.25,43
A1  (via drill 0.6)
  Top 0.305: J1.8B 25.73,5.23 v26,5.5 | U$2.A1 73.95,65.7 72.75,64.5 59.4,64.5 44.9,50 32.5,50 30.88,48.38 U3.18 30.88,40.88 v30.5,40.5
  Bottom 0.305: v26,5.5 26,36 v30.5,40.5
A2  (via drill 0.6)
  Top 0.305: J1.9B 28.27,5.27 v28.5,5.5 | v31.5,40 31.52,41.48 U3.17 31.52,47.52 33,49 45.94,49 59.94,63 74.75,63 76.49,64.74 U$2.A2
  Bottom 0.305: v28.5,5.5 27.25,6.75 27.25,35.75 v31.5,40
A3  (via drill 0.6)
  Top 0.305: J1.10B 30.81,5.31 v31,5.5 | v32.5,41 32.5,41.5 32.17,41.83 U3.16 32.17,46.67 33.5,48 46.98,48 60.48,61.5 77.25,61.5 79.03,63.28 U$2.A3
  Bottom 0.305: v31,5.5 31,37.25 32.5,38.75 v32.5,41
A4  (via drill 0.6)
  Top 0.305: J1.11B 33.35,5.35 v33.5,5.5 | v33.25,41.75 32.83,42.17 U3.15 32.83,45.83 34,47 48.02,47 61.02,60 79.25,60 81.57,62.82 U$2.A4
  Bottom 0.305: v33.5,5.5 33.5,41.5 v33.25,41.75
A5  (via drill 0.6)
  Top 0.305: J1.12B 35.89,5.39 v36,5.5 | v34,42.5 33.48,43.02 U3.14 33.48,44.98 34.5,46 49.06,46 61.56,58.5 81.75,58.5 84.11,61.36 U$2.A5
  Bottom 0.305: v36,5.5 36,25 35,26 35,28.5 36.75,30.25 36.75,40 v34,42.5
A6  (via drill 0.6)
  Top 0.305: J1.13B 38.43,5.43 v38.5,5.5 | v34.75,43.25 34.12,43.88 U3.13
  Bottom 0.305: v38.5,5.5 37.5,6.5 37.5,41 v34.75,43.25
A7  (via drill 0.6)
  Top 0.305: J1.14B 41,3.38 v41,5.5 | v37.5,45 37,45.5 35,45.5 34.77,45.27 U3.12
  Bottom 0.305: v41,5.5 39.5,7 39.5,26 38.25,27 38.5,44 v37.5,45
B0
  Top 0.305: U1.1 59.92,42.92 53,36 40.5,36 35,30.5 30.5,30.5 29.71,29.71 P1.F19
B1
  Top 0.305: U1.3 59.62,41.62 53,35 40.5,35 35.5,30 31,30 30.21,29.21 P1.F17
B2
  Top 0.305: U1.4 62.56,41 60,41 53,34 40.5,34 36,29.5 31.5,29.5 30.71,28.71 P1.F15
B3
  Top 0.305: U1.5 60.33,40.33 53,33 40.5,33 36.5,29 32,29 31.21,28.21 P1.F13
B4
  Top 0.305: U1.6 60.67,39.67 53,32 40.5,32 37,28.5 32.5,28.5 32.22,28.21 P1.F9
B5
  Top 0.305: U1.7 62.56,39 61,39 53,31 40.5,31 37.5,28 33,28 32.72,27.71 P1.F7
B6
  Top 0.305: U1.8 61.38,38.38 53,30 40.25,30 37.75,27.5 37.75,25.75 37,25 35.5,25 35,25.5 35,27.25 34.75,27.5 33.5,27.5 33.22,27.21 P1.F5
B7
  Top 0.305: U1.9 61.73,37.73 53,29 41.75,29 40.94,28.19 40.94,26.69 36.25,22 33.75,22 33.25,22.5 33.25,24.25 33.72,24.71 P1.F3
GND  (via drill 0.6, 1)
  Top 0.305: U3.11 35.51,44.5 v36,44.5 | P1.F11 31.71,24.5 31.75,24.5 | P1.F21 29.21,24.5 29.25,24.5 | P1.F31 26.71,24.25 26.75,24.25 | P1.F41 24.21,24.25 24.25,24.25 | P1.F52 21.71,33.25 21.75,33.25 | P1.F42 24.21,33.25 26.5,33.25 26.71,33.03 P1.F32 | P1.F51 21.71,24.25 21.75,24.25 | P1.P11 31.71,69.5 31.75,69.5 | P1.P21 29.21,69.25 29.25,69.25 | P1.P51 21.71,70.03 22.25,69.5 24,69.5 24.21,69.72 P1.P41 | P1.P31 26.71,69.5 | 26.71,69.5 26.71,68.72 26.5,68.5 | 25.71,78.47 25.71,78.25 26.5,78.25 26.71,78.03 P1.P32 | P1.P12 31.71,75.72 v31.25,75.25 31,75.5 29.75,75.5 29.21,76.03 P1.P22 | P1.F12 31.71,35.97 v32,36.25 | P1.F22 29.21,35.53 v28.75,36 | P1.P35 25.71,69.78 26,69.5 26.71,69.5 | P1.P36 25.71,78.34 v26,78.62 | P1.P42 24.21,78.03 24,78.25 21.75,78.25 | 21.75,78.25 18.25,78.25 v17.25,77.25 | P1.P52 21.71,78.22 21.75,78.25
  Bottom 0.305: v36,44.5 35.5,44.5
  other vias: 43.5,6.75 46.5,6.75 49.5,6.75 52.5,6.75 55.5,6.75 96,21 97.75,21 98,25.25 68,32.5 68,34.5 20.5,23.75 22.5,23.75 18.5,33.5 23,41.25 19.25,54.75 21,54.75 22.75,54.75 41.5,75 39.75,75 9,4.75 91.25,47 46.25,22 5.75,16.25 15,18.25 75.25,1.25 19.25,57.5 21,57.5 22.75,57.5 9.5,38.5 5.5,35.75 5.5,37.75 5.5,39.75 26.25,69.25 28.5,69 30.5,69 24.25,63.25 22.5,63.25 20.75,63.25 32.5,69 21.88,67.88 22.75,65.5 74,22.5 83.75,9 79.25,9 71,9 62.25,9 66.75,1.25 58,1.25 26.5,65.5
  pour Bottom (isolate 0.254): 0,80 100,80 100,0 0,0
  pour Top (isolate 0.254): 0,80 100,80 100,0 0,0
N$1  (via drill 0.6)
  Top 0.305: v26.75,63 25.5,64.25 25.5,65.75 26.25,66.5 26.75,66.5 27.25,67 27.25,70.86 P1.P29
  Bottom 0.305: v26.75,63 27,62.75 87.25,62.75 JTAGBOOT.1
N$2
  Top 0.305: P1.F10 32.22,35.22 32.83,35.83 U3.6
N$3
  Top 0.305: P1.F8 32.72,34.72 33.48,35.48 U3.7 33.48,38.98
N$4
  Top 0.305: P1.F6 33.22,34.22 34.12,35.12 U3.8
N$5
  Top 0.305: P1.F4 33.72,33.72 34.77,34.77 U3.9
  Top 0.406: 34.77,39.02 U3.9
N$6  (via drill 0.6)
  Top 0.305: 19.71,76.78 P1.P60 19.18,77.07 v19,77.25
  Bottom 0.305: JTAG.2 89.75,64 28.5,64 28,64.5 16.25,64.5 16.25,69 19,71.75 v19,77.25
  Bottom 0.406: 16.25,64.5 15.25,64.5 13,62 13,60.5 15.5,58 15.5,57.5 9,51 7.5,51 3.82,47.32 JTAG1.1
N$7
  Top 0.305: JTAG1.3 3.77,49.98 2.5,51.25 2.5,68.25 3,68.75 4,68.75 6,70.75 SJ2.1
N$8
  Top 0.61: 7.5,31 SJ1.1
  Top 1.93: P1.SCREW-4 8.55,31 7.5,31
N$9
  Top 0.305: P1.F23 28.71,28.29 26.5,30.5 19.5,30.5 17.25,32.75 17.25,35.5 16.18,36.58 U2.5
N$10
  Top 0.305: P1.F25 28.21,27.79 26.5,29.5 19.75,29.5 16.77,32.48 16.77,35.23 15.5,36.5 U2.4
N$11
  Top 0.305: P1.F27 27.71,27.29 26.5,28.5 20,28.5 16.12,32.38 16.12,34.88 14.88,36.12 U2.3
N$12
  Top 0.305: P1.F29 27.21,26.79 26.5,27.5 20.25,27.5 15.32,32.42 15.32,34.67 13.57,36.42 U2.1
N$13
  Top 0.305: P1.F30 27.21,33.28 26,34.5 19,34.5 16.82,36.67 U2.6
N$14
  Top 0.305: P1.F28 27.71,33.78 26.5,35 19.5,35 17.48,37.02
N$15
  Top 0.305: P1.F26 28.21,34.28 27,35.5 20,35.5 18.12,37.38 U2.8
N$16
  Top 0.305: P1.F24 28.71,34.78 27.5,36 20.5,36 18.77,37.73 U2.9
N$17
  Top 0.406: USERLED.A 26.92,20.75 27.75,20.75 28.75,19.75 28.75,15 27.5,13.75 18.5,13.75 17.25,15 17.25,18.5 12.75,23 5.5,23 3.25,25.25 R2.1
N$18
  Top 0.254: 11,39 11,43.75 11.5,44.25
  Top 0.305: 11.5,44.25 12.5,45.25
  Top 0.406: USERLED.C 26.67,18 24,18 16.25,25.75 16.25,30.5 13.5,33.25 13.5,35.25 11,37.75 11,39 | 12.5,45.25 12.5,55.25 13.25,56 23.75,56 27,52.75 27.75,52.75 28.75,53.74 ULN2.11
N$19  (via drill 0.6)
  Top 0.305: v22.38,74.88 22.62,74.62 26.12,74.62 27.71,76.22 P1.P28
  Top 0.406: v28.5,66.75 28.75,66.5 ULN2.8
  Bottom 0.406: v28.5,66.75 27,68.25 25.5,68.25 25.25,68 25.25,67 24.5,66.25 23.5,66.25 22.75,67 22.75,74.5 v22.38,74.88
N$20
  Top 0.406: JTAG1.15 3.77,65.77 5.5,67.5 5.5,67.95 SJ3.1
N$21
  Top 0.305: P1.F14 31.21,36.72 32.17,37.67 U3.5
N$22
  Top 0.305: P1.F16 30.71,36.97 31.52,37.77 U3.4
N$23
  Top 0.305: P1.F18 30.21,37.22 30.88,37.88 U3.3
N$24
  Top 0.305: U3.1 29.57,36.85 29.71,36.72 P1.F20
N$25
  Top 0.406: U1.16 76.17,40.33 76.49,40.01 U$2.D3 78.03,26 79,26 81.83,23.18 ULN1.4
N$26
  Top 0.406: U1.15 73.08,39.67 73.95,38.8 U$2.D4 76.24,25.25 78.5,25.25 80.56,23.2 ULN1.5
N$27
  Top 0.406: U1.14 70.97,39.02 71.41,38.59 U$2.D5 74.45,24.5 78.25,24.5 79.28,23.46 ULN1.6
N$28
  Top 0.406: U1.20 79.08,42.92 84.11,37.89 U$2.RX 84.11,24.39 85.64,22.86 ULN1.1
N$29
  Top 0.406: U1.18 78.88,41.62 81.57,38.93 U$2.TX 81.57,25.93 84.36,23.14 ULN1.2
N$30
  Top 0.406: U1.17 77.53,40.98 79.03,39.47 U$2.D2 83.09,23.48 ULN1.3
N$31
  Top 0.406: U1.13 69.62,38.38 70.5,37.5 70.5,28.92 U$2.D6 72.66,23.75 77.25,23.75 78.02,22.98 ULN1.7
N$32
  Top 0.406: U1.12 69.28,37.73 69.5,37.5 69.5,31.96 66.25,28.71 66.25,27.5 U$2.D7 68.12,25.5 69.25,25.5 74.75,20.25 76,20.25 76.75,21 ULN1.8
N$33  (via drill 0.6)
  Top 0.305: v13.5,53 13.57,52.58 U2.20
  Top 0.406: J1.4B 12.92,6 v7.75,6
  Bottom 0.305: U$2.D8 62.52,37.29 46.56,53.25 v13.5,53
  Bottom 0.406: v7.75,6 2.5,11.25 2.5,42.25 13.25,53 v13.5,53
N$34  (via drill 0.6)
  Top 0.305: v14.5,52 14.5,49 14.88,48.62 U2.18
  Top 0.406: J1.5B 14.21,7.25 v7.75,7.25
  Bottom 0.305: U$2.D9 59.98,38.54 46.52,52 v14.5,52
  Bottom 0.406: v7.75,7.25 3.25,11.75 3.25,41.75 13.5,52 v14.5,52
N$35  (via drill 0.6)
  Top 0.305: v15.5,51 15.53,50.52 U2.17
  Top 0.406: J1.6B 15.5,8.5 v8.25,8.5
  Bottom 0.305: U$2.D10 57.44,39.54 45.98,51 v15.5,51
  Bottom 0.406: v8.25,8.5 4,12.75 4,41.25 13.75,51 v15.5,51
N$36  (via drill 0.6)
  Top 0.305: SW0.A' 87.45,6.35 87.25,6.35 | 87.25,6.35 R3.2 | U$2.D11 56.61,29.25 63,29.25 64.5,27.75 64.5,27 67.5,24 69.5,24 74,19.5 84,19.5 87.25,16.25 87.25,6.35 | v17,50 16.18,49.17 U2.16
  Bottom 0.305: U$2.D11 54.9,40.35 45.25,50 v17,50
N$37  (via drill 0.6)
  Top 0.305: 24.71,75.97 P1.P40 | v24.25,75.5 24.71,75.97 | 24.71,75.97 24.75,76 24.75,78.5 24.25,79 13.25,79 12.25,78 12.25,72.25 5.5,65.5 5.5,64.25 3.81,62.56 JTAG1.13
  Bottom 0.305: JTAG.8 93.25,66.5 52,66.5 42.25,76.25 27.75,76.25 26,74.5 25.5,74.5 24.5,75.5 v24.25,75.5
N$38  (via drill 0.6)
  Top 0.305: U$2.SDA 42.2,12.3 46.25,8.25 56.85,8.25 R6.2 61.95,6.35 SW3.A' | v18.75,46.75 18.12,46.12 U2.13
  Bottom 0.305: U$2.SDA 42.2,44.05 39.5,46.75 v18.75,46.75
N$39  (via drill 0.6)
  Top 0.305: U$2.D13 49.82,23.93 51.5,22.25 53.5,22.25 54.25,21.5 54.25,11.5 55.75,10 58.25,10 59.25,11 65,11 66.75,9.25 R5.2 70.45,6.35 SW2.A' | v17.75,47.5 17.48,47.23 U2.14
  Bottom 0.305: U$2.D13 49.82,42.18 44.25,47.75 18,47.75 v17.75,47.5
N$40  (via drill 0.6)
  Top 0.305: U$2.D12 52.36,24.64 54.75,22.25 54.75,12 55.75,11 57,11 57.5,11.5 73,11.5 75.25,9.25 R4.2 78.95,6.35 SW1.A' | v17.75,48.75 16.82,47.83 U2.15
  Bottom 0.305: U$2.D12 52.36,41.14 44.75,48.75 v17.75,48.75
N$41  (via drill 0.6)
  Top 0.305: v20.5,46 19.5,46 18.77,45.27 U2.12
  Bottom 0.305: U$2.SCL 39.66,44.59 38.25,46 v20.5,46
N$43  (via drill 0.6)
  Top 0.305: v25.75,75.5 25.21,76 P1.P38 | v17.5,68.75 9.25,60.25 v9.25,52.5
  Bottom 0.305: JTAG.10 52.88,67 43.12,76.75 27,76.75 v25.75,75.5 24.75,76.5 20.5,76.5 20,76 20,71.25 v17.5,68.75 | v9.25,52.5 3.87,52.5 JTAG1.5
N$45  (via drill 0.6)
  Top 0.305: P1.P37 25.21,68.28 v26.25,67.25 25.5,66.5 22.5,66.5 17.5,61.5 17.5,60.75 v14.5,57.75
  Bottom 0.305: JTAG.4 91,64.75 28.75,64.75 v26.25,67.25 | v14.5,57.75 14.5,57.5 11.94,54.94 JTAG1.7
N$46  (via drill 0.6)
  Top 0.305: P1.P39 24.71,68.53 v24,67.5 22.75,67.5 16.75,61.5 16.75,61 15.25,59.5 14.75,59.5 13,57.75 v13,57.25
  Bottom 0.305: JTAG.6 92.25,65.5 51,65.5 43.25,73.25 35,73.25 33.25,71.5 24.5,71.5 24,71 v24,67.5 | v13,57.25 4,57.25 JTAG1.9
N$47  (via drill 0.6)
  Top 0.406: LED0.A v68.25,23
  Bottom 0.406: v68.25,23 67,23 64.25,25.75 58,25.75 55.84,23.59 RP1.10
N$48  (via drill 0.6)
  Top 0.406: LED1.A v64.25,24.5
  Bottom 0.406: v64.25,24.5 64,24.75 59,24.75 58.25,24 58.25,21.5 57.77,21.02 RP1.9
N$49  (via drill 0.6)
  Top 0.406: LED2.A v60.25,23.25
  Bottom 0.406: v60.25,23.25 60.25,20.25 59.75,19.75 RP1.8
N$50  (via drill 0.6)
  Top 0.406: LED3.A 56.25,22.17 v54.25,24.25
  Bottom 0.406: v54.25,24.25 54.25,19.25 55.02,18.48 RP1.7
N$51  (via drill 0.6)
  Top 0.406: LED4.A 50,18.67 v50,15.5
  Bottom 0.406: v50,15.5 51.71,17.21 RP1.5
N$52
  Top 0.406: LED0.C 68.33,18 68.33,18.08 69,18.75 83.25,18.75 85.64,16.36 ULN1.18
N$53
  Top 0.406: LED1.C 65.42,18.08 67,16.5 69.5,16.5 71,18 82.5,18 84.36,16.14 ULN1.17
N$54
  Top 0.406: LED2.C 60.25,17.25 63.25,14.25 70.75,14.25 71,14.5 76.75,14.5 77.5,15.25 82.5,15.25 83.09,14.65 ULN1.16
N$55  (via drill 0.6)
  Top 0.406: v56.25,11.75 LED3.C | v81.75,14 81.83,13.93 ULN1.15
  Bottom 0.406: v81.75,14 78,10.25 57.75,10.25 v56.25,11.75
N$56  (via drill 0.6)
  Top 0.406: v52.25,15.25 LED4.C | ULN1.14 80.5,12.15 v80.5,14
  Bottom 0.406: v80.5,14 79.5,15 71.75,15 71.5,15.25 61,15.25 60.25,16 53,16 v52.25,15.25
N$57  (via drill 0.6)
  Top 0.406: v48.25,10.25 LED5.C | ULN1.13 79.25,12.13 v79.25,14
  Bottom 0.406: v79.25,14 76.5,11.25 59,11.25 57.25,13 55.25,13 52.5,10.25 v48.25,10.25
N$58  (via drill 0.6)
  Top 0.406: v44.25,12 LED6.C | ULN1.12 78,12.11 v78,14
  Bottom 0.406: v78,14 60,14 59,15 53.75,15 51.75,13 45.25,13 v44.25,12
N$59  (via drill 0.6)
  Top 0.406: v42.5,10.25 40.25,12.5 LED7.C | v74.25,12.25 74.25,11 74.75,10.5 76,10.5 76.75,11.24 ULN1.11
  Bottom 0.406: v74.25,12.25 59.75,12.25 58,14 54.5,14 52.25,11.75 46.75,11.75 45.25,10.25 v42.5,10.25
N$60  (via drill 0.6)
  Top 0.406: LED5.A v48.25,23.5
  Bottom 0.406: v48.25,23.5 48.5,23.25 48.5,19.5 49.52,18.48 RP1.4
N$61  (via drill 0.6)
  Top 0.406: LED6.A v44.25,23.5
  Bottom 0.406: v44.25,23.5 45.75,25 48.75,25 50,23.75 50,20.5 50.75,19.75 RP1.3
N$62  (via drill 0.6)
  Top 0.406: LED7.A 40.25,23 v40.75,23.5
  Bottom 0.406: v40.75,23.5 43.5,26 49.5,26 51,24.5 51,21.75 51.73,21.02 RP1.2
N$63
  Top 0.406: SERIAL.D- 10.8,16.8 11,17 R12.1 C16.1
N$64  (via drill 0.6)
  Top 0.305: 27.25,79.5 34.62,79.5 v35,79.12 | 27.25,79.5 3.25,79.5 1,77.25 1,73 2.25,71.75 7.25,71.75 7.75,71.25 7.7,71.2 SJ2.2 SJ3.2 | 27.25,79.5 27.21,79.22 P1.P30 | v97.75,19.25 95,19.25 94,18.25 RESET.B'
  Bottom 0.406: v97.75,19.25 99.25,20.75 99.25,71.5 98.25,72.5 93.75,72.5 93,71.75 84.5,71.75 83,73.25 71.5,73.25 65.5,79.25 35.12,79.25 v35,79.12
N$65
  Top 0.406: SERIAL.D+ 10.5,16 12.15,14.35 R13.1 C17.1
N$66  (via drill 0.6)
  Top 0.406: J1.2B 10.49,1.99 9.5,1 7.5,1 6.5,2 6.5,8 v8.25,9.75
  Bottom 0.406: v8.25,9.75 R1.B
N$67  (via drill 0.6)
  Top 0.406: v16,17 R12.2
  Bottom 0.406: IC3.9 v16,17
N$68  (via drill 0.6)
  Top 0.406: v16,14 R13.2
  Bottom 0.406: IC3.8 v16,14
N$70  (via drill 0.6)
  Top 0.406: SERIAL.VUSB 9.1,17.6 v10,18.5
  Bottom 1.27: v10,18.5 11.5,20 L2.1
RXD  (via drill 0.6)
  Top 0.305: P1.P24 28.71,74.78 v28.75,74.75
  Top 0.406: v37,74.25 37.25,74.25 38.75,72.75 38.75,63.25 37.5,62 28.5,62 v25.5,59
  Bottom 0.305: v28.75,74.75 29.9,74.75 R14.2 32.4,74.75 34.5,74.75 35,74.25 v37,74.25
  Bottom 0.406: IC3.1 21.72,3.97 21,3.25 8,3.25 1.75,9.5 1.75,42.75 18,59 v25.5,59
TXD  (via drill 0.6)
  Top 0.305: P1.P26 28.21,75.97 26.25,74 21.25,74 19.5,75.5 16.25,75.5 15.44,74.69 | 15.44,74.69 6,65.25 6,42 | R15.2 13.4,76.72 15.44,74.69
  Top 0.406: v18.75,10.5 17.5,9.25 10.75,9.25 10,10 10,12.75 9.25,13.5 6.75,13.5 6,12.75 5,12.75 0.75,17 0.75,36.75 6,42
  Bottom 0.406: v18.75,10.5 19.82,11.57 IC3.4
VCC  (via drill 1)
  Top 0.305: U1.19 67.22,42.27 67,42.5 v67,44 | U2.19 14.22,43.27 14.5,43 | U3.19 30.23,43.52 30.25,43.5 30.25,42.5 29.5,41.75 29,41.75 27.85,42.9 C7.1
  Top 0.406: J1.3B 13.03,1.97 14,1 45,1 46,2 46,3.3 J1.16B 57.45,3.35 R6.1 R5.1 R4.1 R3.1
  Top 0.813: v13,43 C6.1 | C7.1 27.85,44.15 27.75,44.75 | v67,44 C5.1
  Top 1.27: J1.3B 12,4.38 v12,4.5 | 27.75,44.75 22.75,44.75 20.75,43 14.5,43 v13,43 | 27.85,44.15 27.85,49.35 31.5,52.75 43.25,52.75 v45.25,54.75 45.25,58.25 51.09,64.09 U$2.IOREF
  Bottom 0.813: v12,4.5 11.85,5.15 | 14.35,12.15 R1.C | 13,42.75 v13,43
  Bottom 1.27: 11.85,5.15 C10.2 14,6.5 16,8.5 16,10.5 14.35,12.15 | v45.25,54.75 47,54.75 57.75,44 v67,44 82.62,44 C4.+ | R1.C 8.25,17.94 8.25,19.25 14,25 14,29.5 9.5,33.75 9.5,36 13,39.5 v13,43
  Bottom 1.93: JP2.2 93.21,37.04 87.38,43.12 C4.+
VCCIO  (via drill 0.6, 1)
  Top 0.305: U3.10 35.42,36.75 35.42,33.92 v34.75,33.25 34.22,32.72 P1.F2 | U2.2 14.22,39.77 14,40 C2.1 | U3.2 30.23,39.27 29.5,40 C1.1 | P1.P55 20.71,69.5 | U2.10 19.43,39.67 19.5,39.75 | U1.10 64.33,37.08 | 64.47,42.27 U1.2 | v34.75,23.25 34.22,23.79 P1.F1 | P1.P56 20.71,75.78 v21,75.5 20.25,75.5 19.75,76 16.1,76 R15.1
  Top 0.406: 20.71,69.5 v20.74,68.99 | 36.5,36.75 35.42,36.75
  Top 1.27: 14,40 14.75,40.75 v17.25,40.75 18.5,40.75 19.5,39.75 20.75,38.5 27,38.5 27.75,39.25 27.75,39.9 C1.1 | v65,50 63.75,50 61.75,48 61.75,46.5 | 61.75,46.5 61.75,46 62.6,45.15 C3.1 64,45 64.5,44.5 | 64.33,37.08 64.5,37.25 64.5,44.5 | 64.5,44.5 64.47,44.48 64.47,42.27 | 36.5,36.75 37,36.75 38,37.75 53,37.75 61.75,46.5
  Top 1.676: 19.88,68.12 v20.74,68.99
  Top 2.184: v14.5,61.25 11,57.75 v11,45.75 | v19.25,15.75 19.25,19.25 14.25,24.25 14.25,30.25 11.5,33 v11.5,35
  Top 2.54: v14.5,61.25 14.5,62.75 19.88,68.12
  Bottom 0.305: v34.75,33.25 34.25,32.75 34.25,23.75 v34.75,23.25
  Bottom 0.406: C19.2 20.45,10.4 IC3.3 20.45,14.55 v19.25,15.75 18.55,16.45 IC3.11 | R14.1 32.75,73.4 32.75,73 32.25,72.5 26,72.5 22.75,75.75 21.25,75.75 v21,75.5
  Bottom 1.27: v21,75.5 21,69.25 v20.74,68.99
  Bottom 2.184: v11,45.75 14.75,45.75 17.25,43.25 v17.25,40.75 v11.5,35 | v14.5,61.25 46.5,61.25 57.75,50 v65,50
VUSB
  Bottom 0.406: IC3.12 19.18,19.97 19,20.15
  Bottom 1.27: C9.2 19,20.15 C15.2 14.1,20.15 L2.2

### Text on the board
tNames: Tom Keddie June 2014 v1.1 | BOOT | 5 3.3 | + | PARALIO | 3 | 2 | 1 | 0